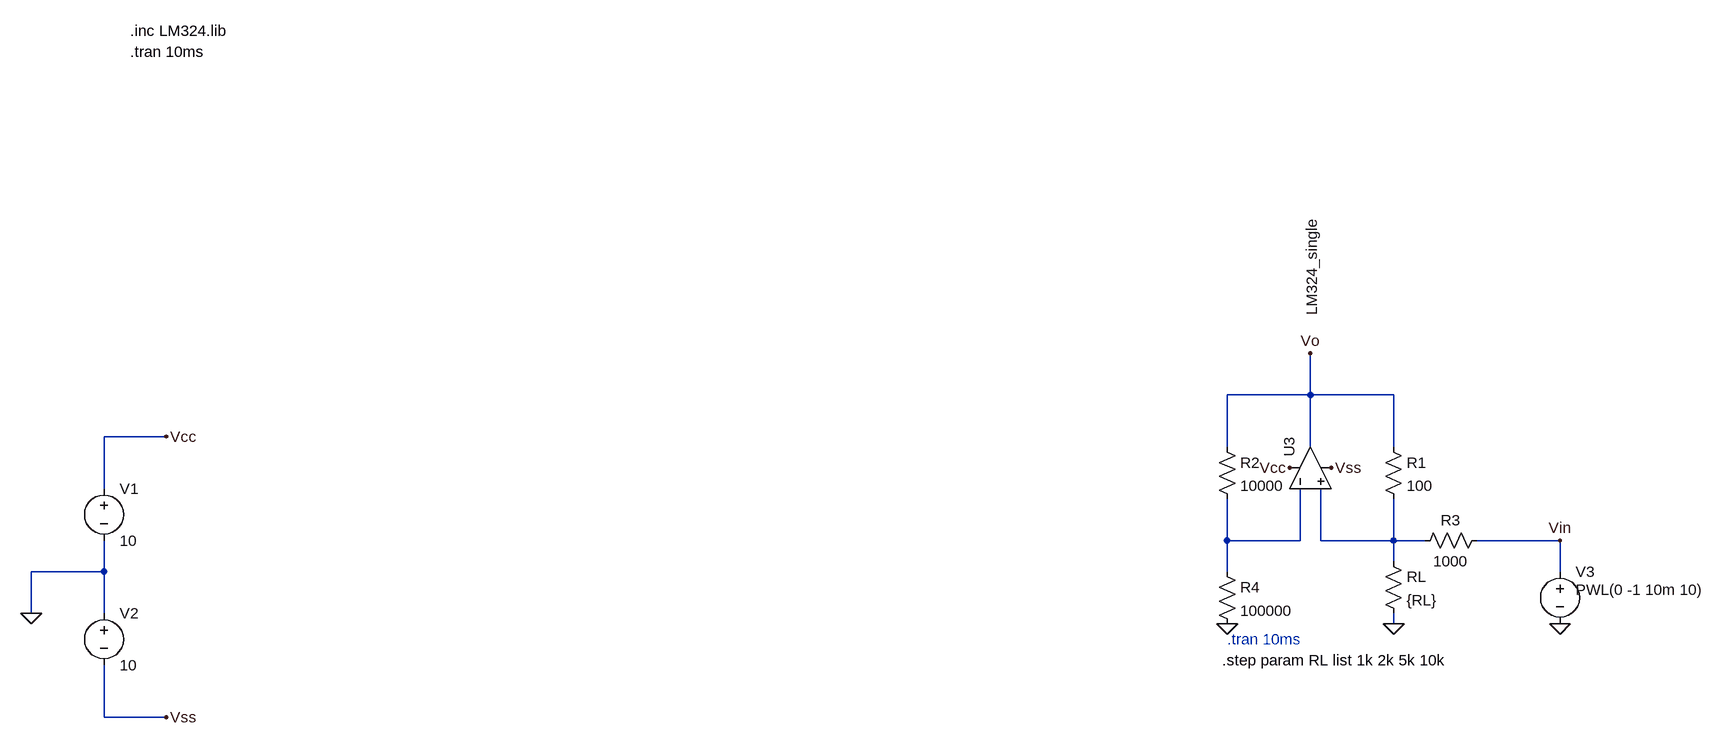
[diagram p0: schematic Circuito 2.asc]
Circuito 2.asc, the LTspice schematic file:
Version 4.1
SHEET 1 4928 940
WIRE 1424 384 1424 320
WIRE 1424 384 1296 384
WIRE 1552 384 1424 384
WIRE -336 448 -432 448
WIRE 1296 464 1296 384
WIRE 1424 464 1424 384
WIRE 1552 464 1552 384
WIRE -432 528 -432 448
WIRE 1296 608 1296 544
WIRE 1408 608 1408 528
WIRE 1408 608 1296 608
WIRE 1440 608 1440 528
WIRE 1552 608 1552 544
WIRE 1552 608 1440 608
WIRE 1600 608 1552 608
WIRE 1808 608 1680 608
WIRE 1552 640 1552 608
WIRE -432 656 -432 608
WIRE -432 656 -544 656
WIRE 1296 656 1296 608
WIRE 1808 656 1808 608
WIRE -544 720 -544 656
WIRE -432 720 -432 656
WIRE 1552 736 1552 720
WIRE -432 880 -432 800
WIRE -336 880 -432 880
FLAG -544 720 0
FLAG -336 448 Vcc
FLAG -336 880 Vss
FLAG 1552 736 0
FLAG 1296 736 0
FLAG 1392 496 Vcc
FLAG 1456 496 Vss
FLAG 1808 736 0
FLAG 1424 320 Vo
FLAG 1808 608 Vin
SYMBOL voltage -432 512 R0
WINDOW 123 0 0 Left 0
WINDOW 39 0 0 Left 0
SYMATTR InstName V1
SYMATTR Value 10
SYMBOL voltage -432 704 R0
WINDOW 123 0 0 Left 0
WINDOW 39 0 0 Left 0
SYMATTR InstName V2
SYMATTR Value 10
SYMBOL OpAmps\\opamp2 1360 496 R270
WINDOW 3 234 66 Left 2
SYMATTR Value LM324_single
SYMATTR InstName U3
SYMBOL res 1696 592 R90
WINDOW 0 0 56 VBottom 2
WINDOW 3 32 56 VTop 2
SYMATTR InstName R3
SYMATTR Value 1000
SYMATTR SpiceLine tol=1
SYMBOL res 1280 640 R0
SYMATTR InstName R4
SYMATTR Value 100000
SYMATTR SpiceLine tol=1
SYMBOL res 1280 448 R0
SYMATTR InstName R2
SYMATTR Value 10000
SYMATTR SpiceLine tol=1
SYMBOL res 1536 448 R0
SYMATTR InstName R1
SYMATTR Value 100
SYMATTR SpiceLine tol=1
SYMBOL res 1536 624 R0
SYMATTR InstName RL
SYMATTR Value {RL}
SYMATTR SpiceLine tol=1
SYMBOL voltage 1808 640 R0
WINDOW 3 24 44 Left 2
WINDOW 123 0 0 Left 0
WINDOW 39 0 0 Left 0
SYMATTR InstName V3
SYMATTR Value PWL(0 -1 10m 10)
TEXT -392 -176 Left 2 !.inc LM324.lib
TEXT -392 -144 Left 2 !.tran 10ms
TEXT 1288 792 Left 2 !.step param RL list 1k 2k 5k 10k
TEXT 1296 760 Left 2 ;.tran 10ms

The netlist it stands for:
* Circuito 2.asc
V1 Vcc 0 10
V2 0 Vss 10
X§U3 N002 N001 Vcc Vss Vo LM324_single  ; pins In+ In- V+ V- OUT
R3 Vin N002 1000 tol=1
R4 N001 0 100000 tol=1
R2 Vo N001 10000 tol=1
R1 Vo N002 100 tol=1
RL N002 0 {RL} tol=1
V3 Vin 0 PWL(0 -1 10m 10)
.inc LM324.lib
.tran 10ms
.step param RL list 1k 2k 5k 10k
* .tran 10ms
.backanno
.end